# EAGLE design button module (EAGLE 8.2.2)
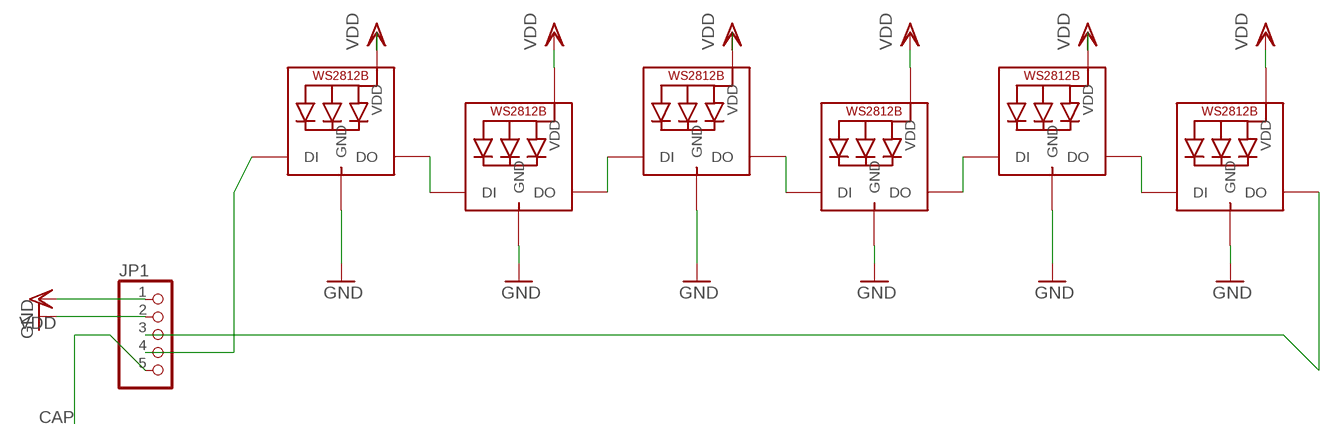
[diagram p0: schematic, sheet 1]

## Parts
JP1  PINHD-1X5  [1X05]
LED1  WS2812B5050  [WS2812B]
LED2  WS2812B5050  [WS2812B]
LED3  WS2812B5050  [WS2812B]
LED4  WS2812B5050  [WS2812B]
LED5  WS2812B5050  [WS2812B]
LED6  WS2812B5050  [WS2812B]

## Nets
CAP: JP1.5
GND: JP1.2 LED1.3-GND(GND) LED2.3-GND(GND) LED3.3-GND(GND) LED4.3-GND(GND) LED5.3-GND(GND) LED6.3-GND(GND)
N$3: JP1.4 LED1.4-DIN(DI)
N$4: JP1.3 LED6.2-DOUT(DO)
N$6: LED1.2-DOUT(DO) LED2.4-DIN(DI)
N$7: LED2.2-DOUT(DO) LED3.4-DIN(DI)
N$8: LED3.2-DOUT(DO) LED4.4-DIN(DI)
N$9: LED4.2-DOUT(DO) LED5.4-DIN(DI)
N$10: LED5.2-DOUT(DO) LED6.4-DIN(DI)
VDD: JP1.1 LED1.1-VDD(VDD) LED2.1-VDD(VDD) LED3.1-VDD(VDD) LED4.1-VDD(VDD) LED5.1-VDD(VDD) LED6.1-VDD(VDD)

## Library data of the parts
JP1 = pinhead:PINHD-1X5: PIN HEADER
LED1-LED6 = adafruit:WS2812B

## Board
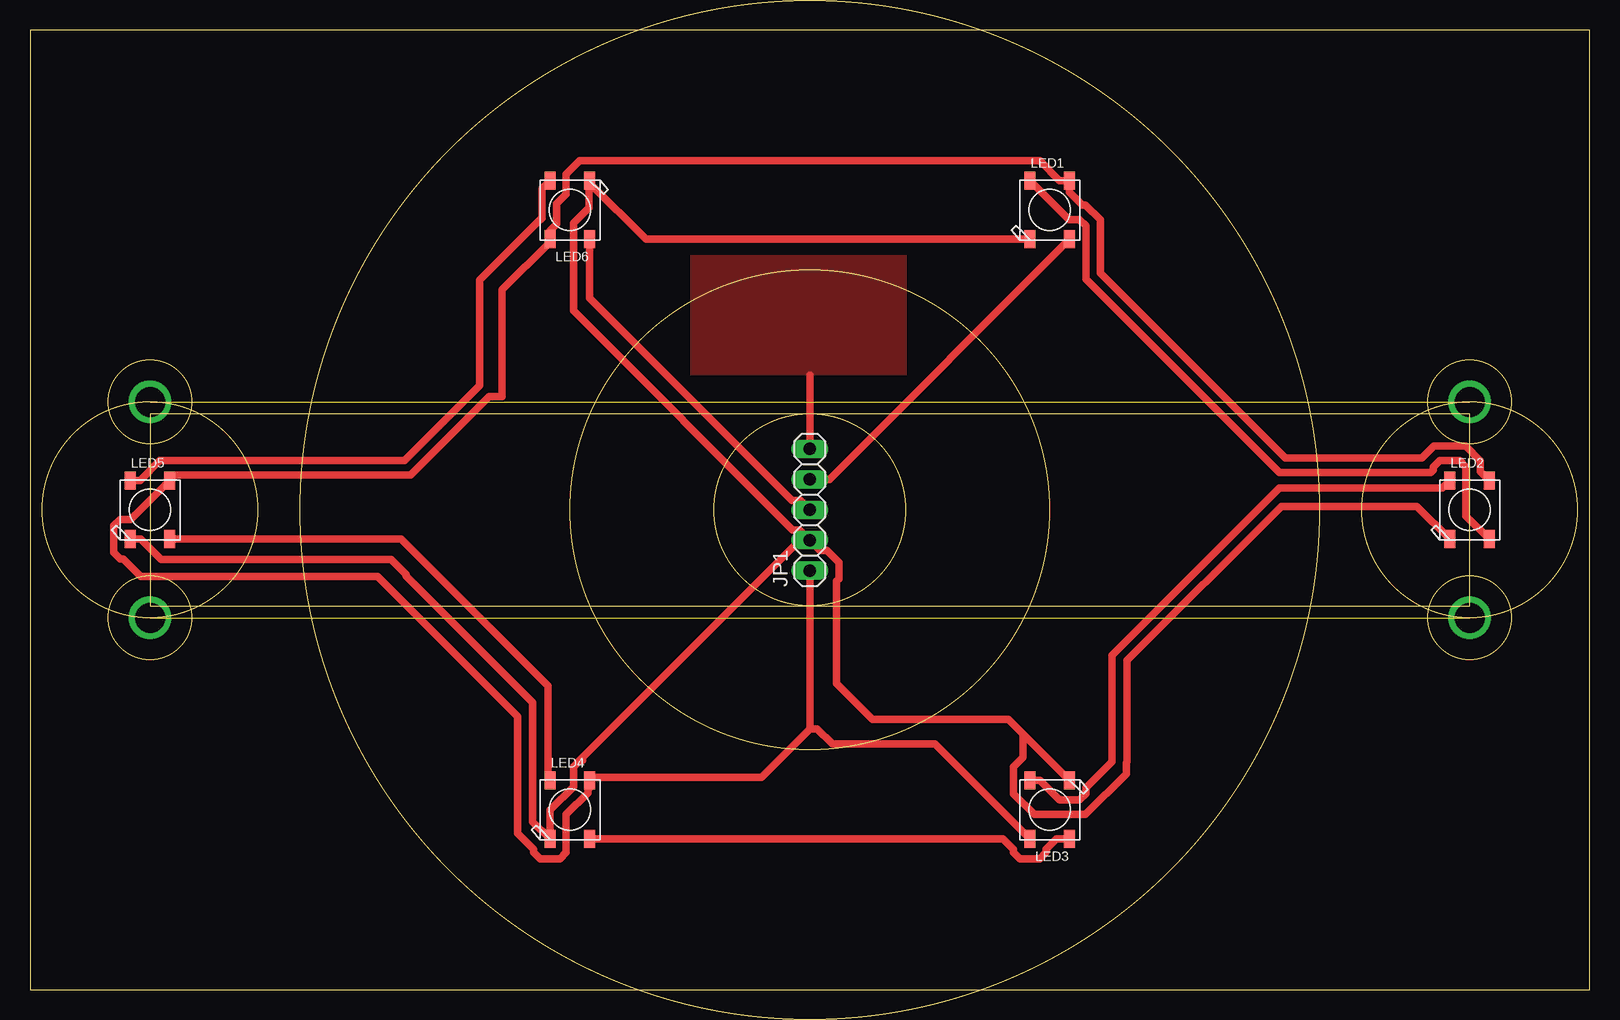
[diagram p1: board, top side]

Size 130 x 80 mm. Coordinates in mm from the lower left corner, seen from the top.
Outline: 0,0 130,0 130,80 0,80 0,0
Copper layers (1*16): Top 0.035mm / dielectric 1.5mm / Bottom 0.035mm
Design rules "fabmodule *": minimum track width 10mil, minimum drill 0.4mm, track to track 0.7mm, track to pad 0.7mm, pad to pad 0.7mm, via to via 0.7mm, smd to smd 0.7mm, copper to edge 40mil, drill to drill 0.8mm, minimum pad ring 10mil, minimum via ring 8mil, stop-mask expansion 4mil, vias tented up to drill 0mil, thermal gap 10mil
Milling: area 22.5,-2.5 to 107.5,82.5; area 111,31 to 129,49; area 6.5,27.5 to 13.5,34.5; area 1,31 to 19,49; area 6.5,45.5 to 13.5,52.5; area 10,32 to 120,48; area 116.5,27.5 to 123.5,34.5; area 116.5,45.5 to 123.5,52.5; area 57,32 to 73,48; area 45,20 to 85,60

### Footprints (pad centres in the part's own frame; a part is rotated, then mirrored left to right if it is on the bottom)
1X05 = drill 1.016 long: 1 -5.08,0; 2 -2.54,0; 3 0,0; 4 2.54,0; 5 5.08,0
WS2812B = smd 1.5 x 0.9: 1-VDD 2.45,-1.65; 2-DOUT 2.45,1.65; 3-GND -2.45,1.65; 4-DIN -2.45,-1.65

### Placement (x,y rotation side)
JP1  65,40 90 top
LED1  85,65 90 top
LED2  120,40 90 top
LED3  85,15 270 top
LED4  45,15 90 top
LED5  10,40 90 top
LED6  45,65 270 top

### Tracks (layer width: path | path; a pad name or v marks a point on that pad's centre or on a via)
CAP
  Top 0.61: JP1.5 65,51.2 65.02,51.23
  pour Top: 73.04,51.22 55.08,51.22 55.08,61.22 73.04,61.22
GND  (1 unrouted)
  Top 0.61: 82.79,21.31 81.57,22.53 70.23,22.53 67.25,25.51 67.25,34.05 67.43,34.23 67.43,35.61 66.45,36.59 65.87,36.59 JP1.2 | 82.79,21.31 LED3.3-GND | 64.78,37.24 JP1.2 | LED1.3-GND 51.34,62.55 46.65,67.23 LED6.3-GND 46.61,67.41 46.61,65.2 45.3,63.88 45.3,56.59 63.55,38.33 64.13,38.33 JP1.2 | LED5.3-GND 9.23,37.55 10.92,35.86 30.1,35.86 31.37,34.59 31.37,34.46 41.91,23.92 41.91,13.99 43.31,12.59 | 45.83,19.11 45.3,18.57 45.3,16.92 43.35,14.97 LED4.3-GND | 45.83,19.11 46.07,19.11 | 82.79,21.31 82.79,19.37 82,18.57 82,16.32 83.73,14.59 87.98,14.59 91.38,17.99 91.38,18.91 91.44,18.97 91.44,27.42 104.3,40.28 115.62,40.28 LED2.3-GND | JP1.2 64.18,37.46 45.83,19.11
N$1  (via drill 2.5)  (1 unrouted)
  other vias: 10,31 120,31
N$2  (via drill 2.5)  (1 unrouted)
  other vias: 10,49 120,49
N$3
  Top 0.61: JP1.4 66.64,42.54 LED1.4-DIN
N$4
  Top 0.61: JP1.3 64.23,40.77 63.51,40.77 46.65,57.63 LED6.2-DOUT
N$6
  Top 0.61: LED2.4-DIN 119.7,39.49 119.7,43.58 119.17,44.1 117.53,44.1 117,43.58 117,43.32 116.78,43.1 104.14,43.1 88,59.23 88,63.67 87.47,64.2 86.59,64.2 LED1.2-DOUT
N$7
  Top 0.61: LED2.2-DOUT 117.73,41.83 104.14,41.83 90.17,27.86 90.17,18.97 88,16.8 88,16.32 87.47,15.79 85.83,15.79 84.17,17.45 LED3.4-DIN
N$8
  Top 0.61: LED3.2-DOUT 85.58,12.55 84.7,11.68 84.7,11.43 84.17,10.89 82.53,10.89 82,11.43 82,11.68 81.12,12.55 LED4.4-DIN
N$9
  Top 0.61: LED5.4-DIN 30.95,37.55 43.18,25.32 43.18,17.62 LED4.2-DOUT
N$10
  Top 0.61: LED5.2-DOUT 9.17,42.45 10.82,44.1 31.23,44.1 37.47,50.34 37.47,59.14 42.52,64.2 42.57,64.2 42.67,64.31 42.67,66.77 LED6.4-DIN
VDD  (1 unrouted)
  Top 0.61: JP1.1 65,21.74 | 65,21.74 60.96,17.7 46.9,17.7 LED4.1-VDD 46.51,17.3 46.51,16.92 | 65,21.74 65.62,21.74 66.88,20.48 75.42,20.48 LED3.1-VDD | 46.69,17.23 46.69,16.85 | 46.69,17.23 46.69,17.45 | 46.69,17.23 46.51,17.05 46.51,16.41 44.7,14.62 44.7,11.43 44.17,10.89 42.52,10.89 41.99,11.43 41.99,11.68 40.64,13.04 40.64,22.78 28.97,34.45 9.22,34.45 7.78,35.89 7.53,35.89 7,36.42 7,38.67 7.53,39.2 8.4,39.2 LED5.1-VDD 12.1,42.9 31.73,42.9 38.29,49.45 39.37,49.45 39.37,58.34 43.35,62.32 LED6.1-VDD 43.35,63.28 43.88,63.81 43.88,65.5 44.7,66.33 44.7,67.98 45.83,69.11 84.17,69.11 85.83,67.45 LED1.1-VDD 86.65,66.49 87.72,65.41 87.98,65.41 89.21,64.18 89.21,59.74 104.64,44.31 116.02,44.31 117.02,45.31 119.68,45.31 120.91,44.08 120.91,43.19 LED2.1-VDD